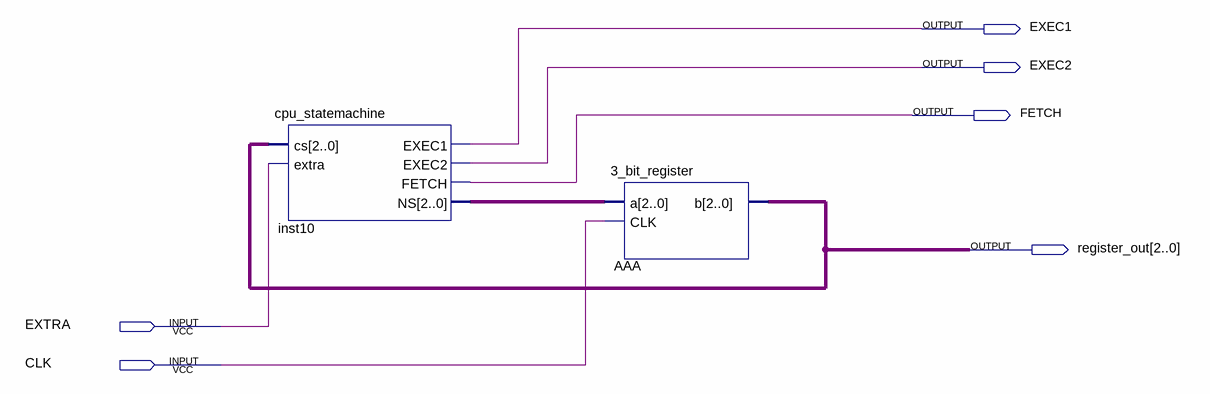
[diagram p0: schematic sheet]
// Quartus schematic statemachineisolatedtest.bdf as structural Verilog: 2 symbols, 6 pins
module statemachineisolatedtest (
  input  EXTRA,
  input  CLK,
  output EXEC1,
  output EXEC2,
  output FETCH,
  output [2:0] register_out
);

  wire [2:0] inst10_ns;

  cpu_statemachine inst10 (
    .cs(register_out), .extra(EXTRA), .EXEC1(EXEC1), .EXEC2(EXEC2), .FETCH(FETCH), .NS(inst10_ns));
  \3_bit_register  AAA (.a(inst10_ns), .CLK(CLK), .b(register_out));
endmodule
